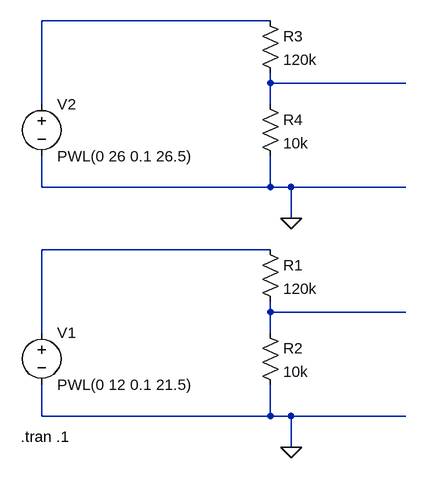
[diagram p0: schematic Volt measure.asc]
Volt measure.asc, the LTspice schematic file:
Version 4
SHEET 1 880 680
WIRE 384 -288 32 -288
WIRE 384 -192 384 -208
WIRE 592 -192 384 -192
WIRE 32 -160 32 -288
WIRE 384 -160 384 -192
WIRE 32 -32 32 -80
WIRE 384 -32 384 -80
WIRE 384 -32 32 -32
WIRE 416 -32 384 -32
WIRE 592 -32 416 -32
WIRE 416 16 416 -32
WIRE 384 64 32 64
WIRE 384 160 384 144
WIRE 592 160 384 160
WIRE 32 192 32 64
WIRE 384 192 384 160
WIRE 32 320 32 272
WIRE 384 320 384 272
WIRE 384 320 32 320
WIRE 416 320 384 320
WIRE 592 320 416 320
WIRE 416 368 416 320
FLAG 416 368 0
FLAG 416 16 0
SYMBOL res 368 48 R0
SYMATTR InstName R1
SYMATTR Value 120k
SYMBOL res 368 176 R0
SYMATTR InstName R2
SYMATTR Value 10k
SYMBOL voltage 32 176 R0
WINDOW 123 0 0 Left 0
WINDOW 39 0 0 Left 0
SYMATTR InstName V1
SYMATTR Value PWL(0 12 0.1 21.5)
SYMBOL res 368 -304 R0
SYMATTR InstName R3
SYMATTR Value 120k
SYMBOL res 368 -176 R0
SYMATTR InstName R4
SYMATTR Value 10k
SYMBOL voltage 32 -176 R0
WINDOW 123 0 0 Left 0
WINDOW 39 0 0 Left 0
SYMATTR InstName V2
SYMATTR Value PWL(0 26 0.1 26.5)
TEXT 0 352 Left 0 !.tran .1

The netlist it stands for:
* Volt measure.asc
R1 N003 N004 120k
R2 N004 0 10k
V1 N003 0 PWL(0 12 0.1 21.5)
R3 N001 N002 120k
R4 N002 0 10k
V2 N001 0 PWL(0 26 0.1 26.5)
.tran .1
.backanno
.end